# Altium schematic sheet Sch_mcu.SchDoc
size A
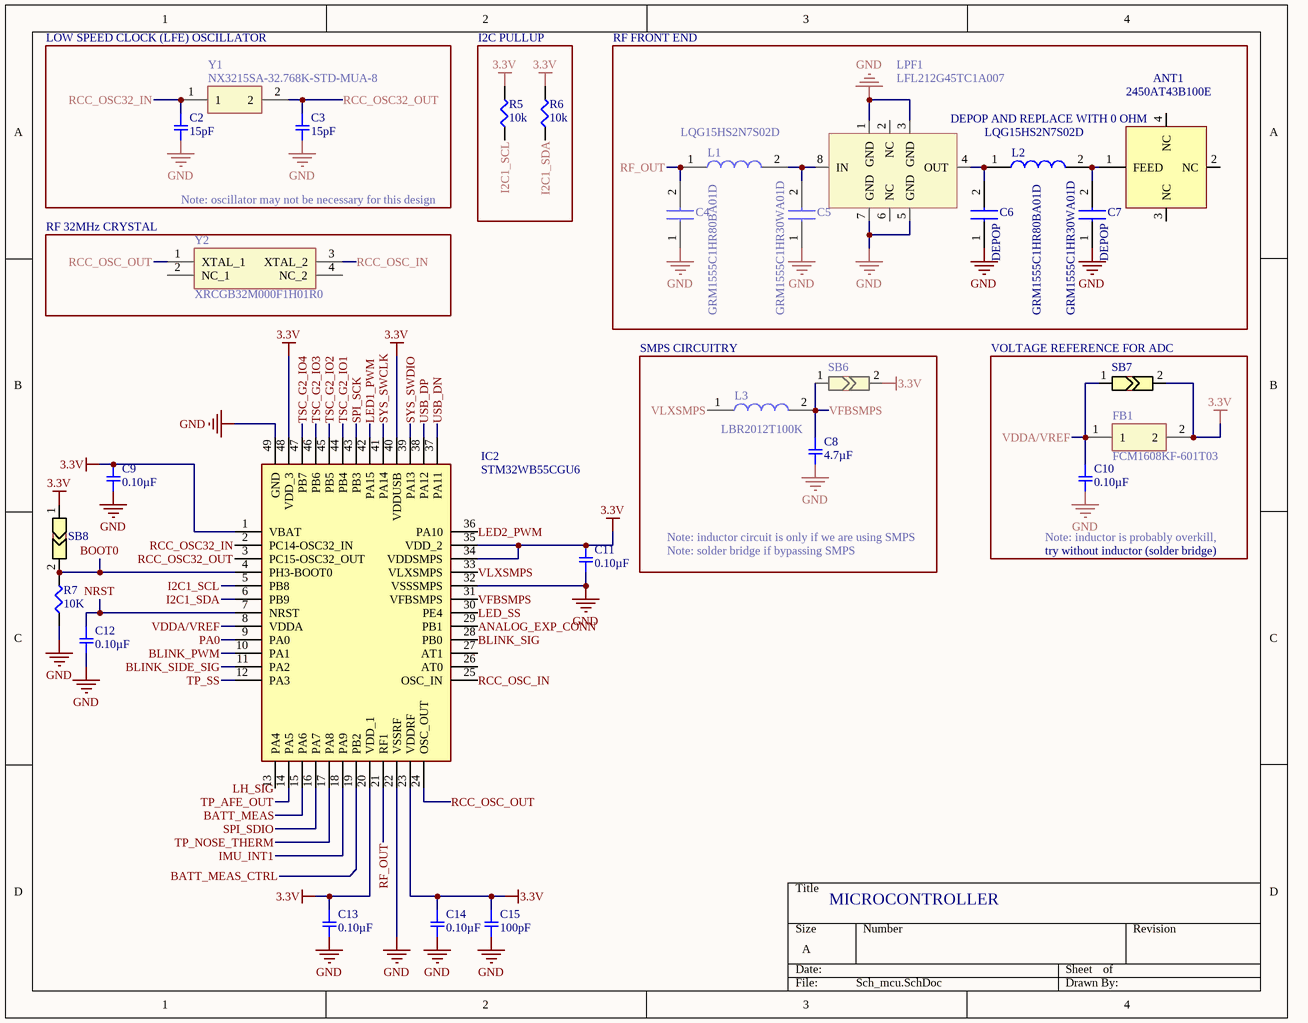
[diagram p0: Sch_mcu.SchDoc]

## Parts
ANT1  2450AT43B100E  [2450AT43B100E]
C2  15pF  [SMD-0402C]
C3  15pF  [SMD-0402C]
C4  GRM1555C1HR80BA01D  [CAPC1005X55N]
C5  GRM1555C1HR30WA01D  [CAPC1005X55N]
C6  GRM1555C1HR80BA01D  [CAPC1005X55N]
C7  GRM1555C1HR30WA01D  [CAPC1005X55N]
C8  4.7µF  [SMD-0402C]
C9  0.10µF  [SMD-0402C]
C10  0.10µF  [SMD-0402C]
C11  0.10µF  [SMD-0402C]
C12  0.10µF  [SMD-0402C]
C13  0.10µF  [SMD-0402C]
C14  0.10µF  [SMD-0402C]
C15  100pF  [SMD-0402C]
FB1  FCM1608KF-601T03  [BEADC1608X95N]
IC2  STM32WB55CGU6  [QFN50P700X700X65-49N-D]
L1  LQG15HS2N7S02D  [INDC1005X55N]
L2  LQG15HS2N7S02D  [INDC1005X55N]
L3  LBR2012T100K  [INDC2012X145N]
LPF1  LFL212G45TC1A007  [LFL212G45TC1A007]
R5  10k  [SMD-0402-RES]
R6  10k  [SMD-0402-RES]
R7  10K  [SMD-0402-RES]
SB6  SOLDER_JUMPER  [JUMPER_SMD]  (value not drawn)
SB7  SOLDER_JUMPER  [JUMPER_SMD]  (value not drawn)
SB8  SOLDER_JUMPER  [JUMPER_SMD]  (value not drawn)
Y1  NX3215SA-32.768K-STD-MUA-8  [NX3215SA]
Y2  XRCGB32M000F1H01R0  [XRCGB32M000F1H01R0]

## Blocks framed on the sheet
I2C PULLUP: R5 R6
RF 32MHz CRYSTAL: Y2

## Nets
3.3V: C9.1 C11.1 C13.1 C14.1 C15.1 FB1.2 IC2.1(VBAT) IC2.20(VDD_1) IC2.23(VDDRF) IC2.34(VDDSMPS) IC2.35(VDD_2) IC2.40(VDDUSB) IC2.48(VDD_3) R5.2 R6.2 SB6.2 SB7.2 SB8.1
GND: C2.2 C3.2 C4.1 C5.1 C6.1 C7.1 C8.2 C9.2 C10.2 C11.2 C12.2 C13.2 C14.2 C15.2 IC2.22(VSSRF) IC2.32(VSSSMPS) IC2.49(GND) LPF1.1(GND) LPF1.3(GND) LPF1.5(GND) LPF1.7(GND) R7.1
ANALOG_EXP_CONN: IC2.29(PB1)
BATT_MEAS: IC2.15(PA6)
BATT_MEAS_CTRL: IC2.19(PB2)
BLINK_PWM: IC2.10(PA1)
BLINK_SIDE_SIG: IC2.11(PA2)
BLINK_SIG: IC2.28(PB0)
BOOT0: IC2.4(PH3-BOOT0) R7.2 SB8.2
I2C1_SCL: IC2.5(PB8) R5.1
I2C1_SDA: IC2.6(PB9) R6.1
IMU_INT1: IC2.18(PA9)
LED1_PWM: IC2.42(PA15)
LED2_PWM: IC2.36(PA10)
LED_SS: IC2.30(PE4)
LH_SIG: IC2.13(PA4)
NRST: C12.1 IC2.7(NRST)
PA0: IC2.9(PA0)
RCC_OSC32_IN: C2.1 IC2.2(PC14-OSC32_IN) Y1.1
RCC_OSC32_OUT: C3.1 IC2.3(PC15-OSC32_OUT) Y1.2
RCC_OSC_IN: IC2.25(OSC_IN) Y2.3(XTAL_2)
RCC_OSC_OUT: IC2.24(OSC_OUT) Y2.1(XTAL_1)
RF_OUT: C4.2 IC2.21(RF1) L1.1
SPI_SCK: IC2.43(PB3)
SPI_SDIO: IC2.16(PA7)
SYS_SWCLK: IC2.41(PA14)
SYS_SWDIO: IC2.39(PA13)
TP_AFE_OUT: IC2.14(PA5)
TP_NOSE_THERM: IC2.17(PA8)
TP_SS: IC2.12(PA3)
TSC_G2_IO1: IC2.44(PB4)
TSC_G2_IO2: IC2.45(PB5)
TSC_G2_IO3: IC2.46(PB6)
TSC_G2_IO4: IC2.47(PB7)
USB_DN: IC2.37(PA11)
USB_DP: IC2.38(PA12)
VDDA/VREF: C10.1 FB1.1 IC2.8(VDDA) SB7.1
VFBSMPS: C8.1 IC2.31(VFBSMPS) L3.2 SB6.1
VLXSMPS: IC2.33(VLXSMPS) L3.1
NetANT1_1: ANT1.1(FEED) C7.2 L2.2
NetC5_2: C5.2 L1.2 LPF1.8(IN)
NetC6_2: C6.2 L2.1 LPF1.4(OUT)

Not connected (* = marked no-connect by the designer): ANT1 2(NC) 3(NC) 4(NC); IC2 26(AT0) 27(AT1); LPF1 2(NC) 6(NC); Y2 2(NC_1) 4(NC_2)

## Notes on the sheet
- LOW SPEED CLOCK (LFE) OSCILLATOR
- RF FRONT END
- DEPOP AND REPLACE WITH 0 OHM
- Note: oscillator may not be necessary for this design
- (near C6) DEPOP
- (near C7) DEPOP
- SMPS CIRCUITRY
- (near SB7) VOLTAGE REFERENCE FOR ADC
- Note: inductor circuit is only if we are using SMPS
- Note: solder bridge if bypassing SMPS
- (near C10) Note: inductor is probably overkill,
- try without inductor (solder bridge)
- MICROCONTROLLER

## Library data of the parts
C2 C3 = GCM1555C1H150JA16D: CAP CER 15PF 50V NP0 0402; Manufacturer: Murata Electronics North America; Factory Stock: 0; Unit Price (USD): 0.1; Minimum Quantity: 1; Tolerance: ±5%; Temperature Coefficient: C0G, NP0; Datasheets: http://www.murata.com/~/media/webrenewal/support/library/catalog/products/capacitor/mlcc/c03e.ashx; Image: //media.digikey.com/Renders/Murata%20Renders/ZRB-SERIES-0402.jpg; Digi-Key Part Number: 490-11147-1-ND; Part Number: GCM1555C1H150JA16D; Quantity Available: 6185; @ qty: 0; Packaging: Cut Tape (CT); Series: GCM; Part Status: Active; Value: 15pF; Voltage: 50V; Operating Temperature: -55°C ~ 125°C; Features: -; Ratings: AEC-Q200; Applications: Automotive; Mounting Type: Surface Mount, MLCC; Package / Case: 0402 (1005 Metric); Size / Dimension: 0.039" L x 0.020" W (1.00mm x 0.50mm); Height - Seated (Max): -; Thickness (Max): 0.022" (0.55mm); Lead Spacing: -; Lead Style: -
C4 C6 = GRM1555C1HR80BA01D: Capacitor; Manufacturer_Name: Murata Electronics; Datasheet Link: http://www.murata.com/~/media/webrenewal/support/library/catalog/products/capacitor/mlcc/c02e.pdf; Height: 0.55mm; Manufacturer_Part_Number: GRM1555C1HR80BA01D; Mouser Part Number: 81-GRM1555C1HR80BA1D; Mouser Price/Stock: https://www.mouser.com/Search/Refine.aspx?Keyword=81-GRM1555C1HR80BA1D; RS Part Number: 8145426P; RS Price/Stock: http://uk.rs-online.com/web/p/products/8145426P
C5 C7 = GRM1555C1HR30WA01D: Capacitor; Manufacturer_Name: Murata Electronics; Datasheet Link: http://www.murata.com/~/media/webrenewal/support/library/catalog/products/capacitor/mlcc/c02e.pdf; Height: 0.55mm; Manufacturer_Part_Number: GRM1555C1HR30WA01D; Mouser Part Number: 81-GRM1555C1HR30WA1D; Mouser Price/Stock: https://www.mouser.com/Search/Refine.aspx?Keyword=81-GRM1555C1HR30WA1D; RS Part Number: 8145394P; RS Price/Stock: http://uk.rs-online.com/web/p/products/8145394P
C8 = GRM153R60G475ME15D: CAP CER 4.7UF 4V X5R 0402; Manufacturer: Murata Electronics North America; Factory Stock: 0; Unit Price (USD): 0.27; Minimum Quantity: 1; Tolerance: ±20%; Datasheets: http://psearch.en.murata.com/capacitor/product/GRM153R60G475ME15%23.pdf; Image: //media.digikey.com/Renders/Murata%20Renders/ZRB-SERIES-0402.jpg; Digi-Key Part Number: 490-13231-1-ND; Part Number: GRM153R60G475ME15D; Quantity Available: 9100; @ qty: 0; Packaging: Cut Tape (CT); Series: GRM; Part Status: Active; Value: 4.7µF; Voltage: 4V; Temperature Coefficient: X5R; Operating Temperature: -55°C ~ 85°C; Features: -; Ratings: -; Applications: General Purpose; Mounting Type: Surface Mount, MLCC; Package / Case: 0402 (1005 Metric); Size / Dimension: 0.039" L x 0.020" W (1.00mm x 0.50mm); Height - Seated (Max): -; Thickness (Max): 0.013" (0.33mm); Lead Spacing: -; Lead Style: -
C9-C14 = GCM155R71C104KA55D: CAP CER 0.1UF 16V X7R 0402; Manufacturer: Murata Electronics North America; Factory Stock: 0; Unit Price (USD): 0.1; Minimum Quantity: 1; Tolerance: ±10%; Datasheets: http://www.murata.com/~/media/webrenewal/support/library/catalog/products/capacitor/mlcc/c03e.ashx; Image: //media.digikey.com/Renders/Murata%20Renders/ZRB-SERIES-0402.jpg; Digi-Key Part Number: 490-4759-1-ND; Part Number: GCM155R71C104KA55D; Quantity Available: 734194; @ qty: 0; Packaging: Cut Tape (CT); Series: GCM; Part Status: Active; Value: 0.10µF; Voltage: 16V; Temperature Coefficient: X7R; Operating Temperature: -55°C ~ 125°C; Features: -; Ratings: AEC-Q200; Applications: Automotive; Mounting Type: Surface Mount, MLCC; Package / Case: 0402 (1005 Metric); Size / Dimension: 0.039" L x 0.020" W (1.00mm x 0.50mm); Height - Seated (Max): -; Thickness (Max): 0.022" (0.55mm); Lead Spacing: -; Lead Style: -
C15 = GCM1555C1H101JA16D: CAP CER 100PF 50V NP0 0402; Manufacturer: Murata Electronics North America; Factory Stock: 0; Unit Price (USD): 0.1; Minimum Quantity: 1; Tolerance: ±5%; Temperature Coefficient: C0G, NP0; Datasheets: http://www.murata.com/~/media/webrenewal/support/library/catalog/products/capacitor/mlcc/c03e.ashx; Image: //media.digikey.com/Renders/Murata%20Renders/ZRB-SERIES-0402.jpg; Digi-Key Part Number: 490-10669-1-ND; Part Number: GCM1555C1H101JA16D; Quantity Available: 61397; @ qty: 0; Packaging: Cut Tape (CT); Series: GCM; Part Status: Active; Value: 100pF; Voltage: 50V; Operating Temperature: -55°C ~ 125°C; Features: -; Ratings: AEC-Q200; Applications: Automotive; Mounting Type: Surface Mount, MLCC; Package / Case: 0402 (1005 Metric); Size / Dimension: 0.039" L x 0.020" W (1.00mm x 0.50mm); Height - Seated (Max): -; Thickness (Max): 0.022" (0.55mm); Lead Spacing: -; Lead Style: -
FB1 = FCM1608KF-601T03: Ferrite Bead; Manufacturer_Name: TAI-TECH; Datasheet Link: https://www.tai-tech.com.tw/_upload/files/FCM1608-Series.pdf; Height: 0.95mm; Manufacturer_Part_Number: FCM1608KF-601T03
IC2 = STM32WB55CGU6: Integrated Circuit; Manufacturer_Name: STMicroelectronics; Datasheet Link: https://www.st.com/en/microcontrollers/stm32wb55cg.html; Height: 0.65mm; Manufacturer_Part_Number: STM32WB55CGU6; Mouser Part Number: 511-STM32WB55CGU6; Mouser Price/Stock: https://www.mouser.com/Search/Refine.aspx?Keyword=511-STM32WB55CGU6
L1 L2 = LQG15HS2N7S02D: Inductor; Manufacturer_Name: Murata Electronics; Datasheet Link: https://www.arrow.com/en/products/lqg15hs2n7s02d/murata-manufacturing; Height: 0.55mm; Manufacturer_Part_Number: LQG15HS2N7S02D
L3 = LBR2012T100K: Inductor; Manufacturer_Name: TAIYO YUDEN; Datasheet Link: https://componentsearchengine.com/Datasheets/2/LBR2012T100K.pdf; Height: 1.45mm; Manufacturer_Part_Number: LBR2012T100K; Mouser Part Number: 963-LBR2012T100K; Mouser Price/Stock: https://www.mouser.com/Search/Refine.aspx?Keyword=963-LBR2012T100K
R5 R6 = ERJ-2GEJ103X: RES SMD 10K OHM 5% 1/10W 0402; Manufacturer: Panasonic Electronic Components; Factory Stock: 0; Unit Price (USD): 0.00350; @ qty: 1500; Minimum Quantity: 1; Power (Watts): 0.1W, 1/10W; Temperature Coefficient: ±200ppm/°C; Part Number: ERJ-2GEJ103X; Datasheets: http://industrial.panasonic.com/www-cgi/jvcr13pz.cgi?E+PZ+3+AOA0001+ERJ2GEJ103X+7+WW; Image: //media.digikey.com/Photos/Panasonic%20Photos/ERJ-PA2-Series.jpg; Digi-Key Part Number: P10KJCT-ND; Quantity Available: 2560215; Packaging: Cut Tape (CT); Series: ERJ; Part Status: Active; Value: 10k; Tolerance: ±5%; Composition: Thick Film; Features: Automotive AEC-Q200; Operating Temperature: -55°C ~ 155°C; Package / Case: 0402 (1005 Metric); Supplier Device Package: 0402; Size / Dimension: 0.039" L x 0.020" W (1.00mm x 0.50mm); Height - Seated (Max): 0.016" (0.40mm); Number of Terminations: 2; Failure Rate: -
R7 = ERJ-2RKF1003X: RES SMD 10K OHM 1% 1/10W 0402; Manufacturer: Panasonic Electronic Components; Factory Stock: 0; Unit Price (USD): 0.00496; @ qty: 1500; Minimum Quantity: 1; Power (Watts): 0.1W, 1/10W; Temperature Coefficient: ±100ppm/°C; Part Number: ERJ-2RKF1003X; Datasheets: http://industrial.panasonic.com/www-cgi/jvcr13pz.cgi?E+PZ+3+AOA0002+ERJ2RKF1003X+7+WW; Image: //media.digikey.com/Photos/Panasonic%20Photos/ERJ-PA2-Series.jpg; Digi-Key Part Number: P100KLCT-ND; Quantity Available: 2645965; Packaging: Cut Tape (CT); Series: ERJ; Part Status: Active; Value: 10K; Tolerance: ±1%; Composition: Thick Film; Features: Automotive AEC-Q200; Operating Temperature: -55°C ~ 155°C; Package / Case: 0402 (1005 Metric); Supplier Device Package: 0402; Size / Dimension: 0.039" L x 0.020" W (1.00mm x 0.50mm); Height - Seated (Max): 0.016" (0.40mm); Number of Terminations: 2; Failure Rate: -
Y1 = NX3215SA-32.768K-STD-MUA-8: Crystal or Oscillator; Manufacturer_Name: NDK; Datasheet Link: http://www.ndk.com/images/products/catalog/c_NX3215SA-STD-MUA-14_e.pdf; Manufacturer_Part_Number: NX3215SA-32.768K-STD-MUA-8; Mouser Part Number: 344-NX3215SA32768K8; Mouser Price/Stock: https://www.mouser.com/Search/Refine.aspx?Keyword=344-NX3215SA32768K8
Y2 = XRCGB32M000F1H01R0: Crystal or Oscillator; Manufacturer_Name: Murata Electronics; Datasheet Link: https://www.murata.com/en-eu/products/productdetail?partno=XRCGB32M000F1H01R0; Height: 0.7mm; Manufacturer_Part_Number: XRCGB32M000F1H01R0; Mouser Part Number: 81-XRCGB32M000F1H01R; Mouser Price/Stock: https://www.mouser.com/Search/Refine.aspx?Keyword=81-XRCGB32M000F1H01R